# Altium project LM331.PrjPCB
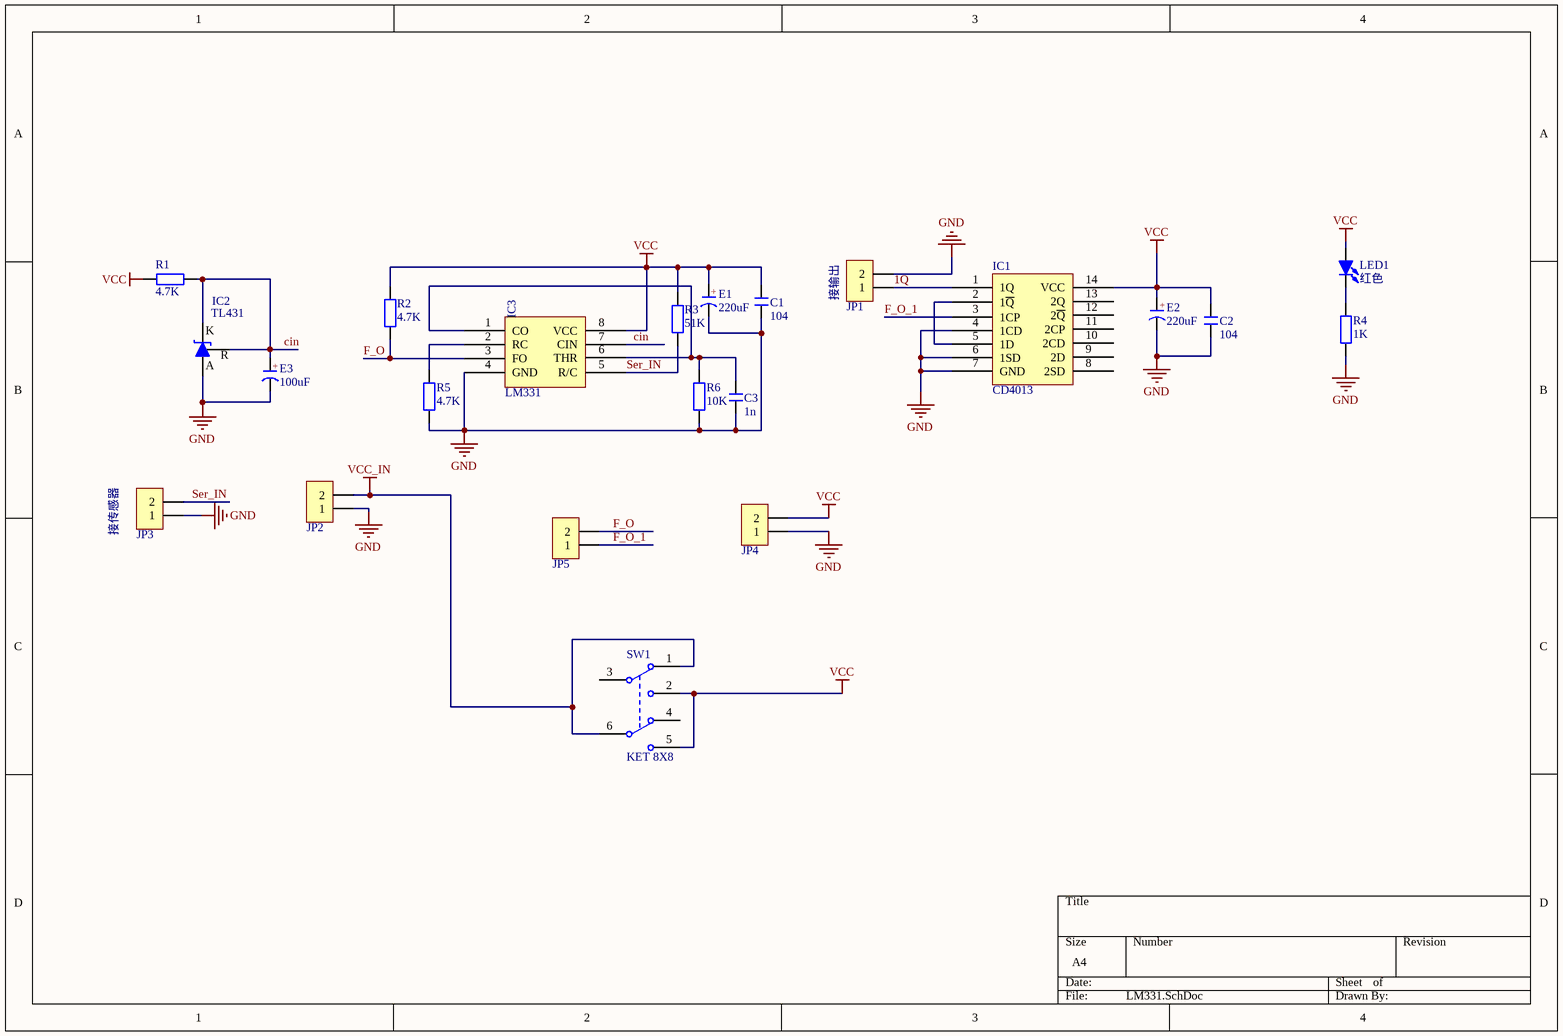
[diagram p0: LM331.SchDoc]
1 sheet, 22 parts. Net scope: global (net labels, ports and power ports of the same name join across sheets).
Board file: LM331MCU.PcbDoc

## Sheet LM331.SchDoc
size A4

### Parts
C1  104  [C 0805_M]
C2  104  [C 0805_M]
C3  1n  [C 0805_M]
E1  220uF  [CAP 3.5*8*11.5]
E2  220uF  [CAP 3.5*8*11.5]
E3  100uF  [CAP 3.5*8*11.5]
IC1  CD4013  [SOP14_M]
IC2  TL431  [TO92A]
IC3  LM331  [SOP8_M]
JP1  HDR-1X2  [XH2.54-LI-2P]  (value not drawn)
JP2  HDR-1X2  [XH2.54-LI-2P]  (value not drawn)
JP3  HDR-1X2  [KF2EDGK5.0-LI-2P]  (value not drawn)
JP4  HDR-1X2  [XH2.54-LI-2P]  (value not drawn)
JP5  HDR-1X2  [XH2.54-LI-2P]  (value not drawn)
LED1  红色  [LED 5MM-B]
R1  4.7K  [R 0805_M]
R2  4.7K  [R 0805_M]
R3  51K  [RS 1/4W]
R4  1K  [RS 1/4W]
R5  4.7K  [R 0805_M]
R6  10K  [R 0805_M]
SW1  KET 8X8  [KFT DIP-8X8]

### Nets
GND: C1.1 C2.1 C3.1 E1.2(K) E2.2(K) E3.2(K) IC1.4(1CD) IC1.6(1SD) IC1.7(GND) IC2.2(A) IC3.4(GND) JP1.2 JP2.1 JP3.1 JP4.1 R4.1 R5.1 R6.1
VCC: C1.2 C2.2 E1.1(A) E2.1(A) IC1.14(VCC) IC3.8(VCC) JP4.2 LED1.1(A) R1.2 R2.2 R3.2 SW1.2(COM2) SW1.5(COM2)
VCC_IN: JP2.2 SW1.1(NC1) SW1.6(NC2)
1Q: IC1.1(1Q) JP1.1
cin: E3.1(A) IC2.1(R) IC2.3(K) IC3.7(CIN) R1.1
F_O: IC3.3(FO) JP5.2 R2.1
F_O_1: IC1.3(1CP) JP5.1
Ser_IN: IC3.5(R/C) JP3.2 R3.1
NetC3_2: C3.2 IC3.1(CO) IC3.6(THR) R6.2
NetIC1_2: IC1.2(1~{Q}) IC1.5(1D)
NetIC3_2: IC3.2(RC) R5.2
NetLED1_2: LED1.2(K) R4.2

Not connected (* = marked no-connect by the designer): IC1 8(2SD) 9(2D) 10(2CD) 11(2CP) 12(2~{Q}) 13(2Q); SW1 3(NO1) 4(NO2)

### Notes on the sheet
- (near JP1) 接输出
- (near JP3) 接传感器
- (in symbol C-CAP) +

### Library data of the parts
C1-C3 = C: 无极性贴片电容; 版权归属: 源创客; BOM名称: 无极性贴片电容; 学习资源: www.ooocke.com
E1-E3 = C-CAP: 直插电解电容; 版权归属: 源创客; BOM名称: 直插电解电容; 学习资源: www.ooocke.com
IC2 = TL431-ID: 可调基准稳压芯片; 版权归属: 源创客; BOM名称: 可调基准稳压芯片; 学习资源: www.ooocke.com
IC3 = LM331: 频率电压转换器
JP1-JP5 = Header 2: 2P接插件; 版权归属: 源创客; BOM名称: 2P接插件; 学习资源: www.ooocke.com
LED1 = LED-5MM: 5mm插件LED; 版权归属: 源创客; BOM名称: 5mm插件LED; 学习资源: www.ooocke.com
R1 R2 R5 R6 = R: 贴片电阻; 版权归属: 源创客; BOM名称: 贴片电阻; 学习资源: www.ooocke.com
R3 R4 = R-CRR: 直插色环电阻; BOM名称: 色环电阻; 版权归属: 源创客; 学习资源: www.ooocke.com
SW1 = KET 8X8: 8*8自锁开关; 版权归属: 源创客; BOM名称: 8*8自锁开关; 学习资源: www.ooocke.com